# EAGLE design Serial_CAN_Bus_V1.1 (EAGLE 6.4)
DESCRIPTION: microOBD 200 OBD-II Module; HW_REV: 1.4; PCB_REV: C; PCB_SPEC1: Layer Count: 4; PCB_SPEC2: Size: 1.3" x 0.59"; PCB_SPEC3: Finish Thickness: 0.049" - 0.052"; PCB_SPEC4: Copper Weight: 1oz; TITLE: STM1120

## Sheet 1 of 2
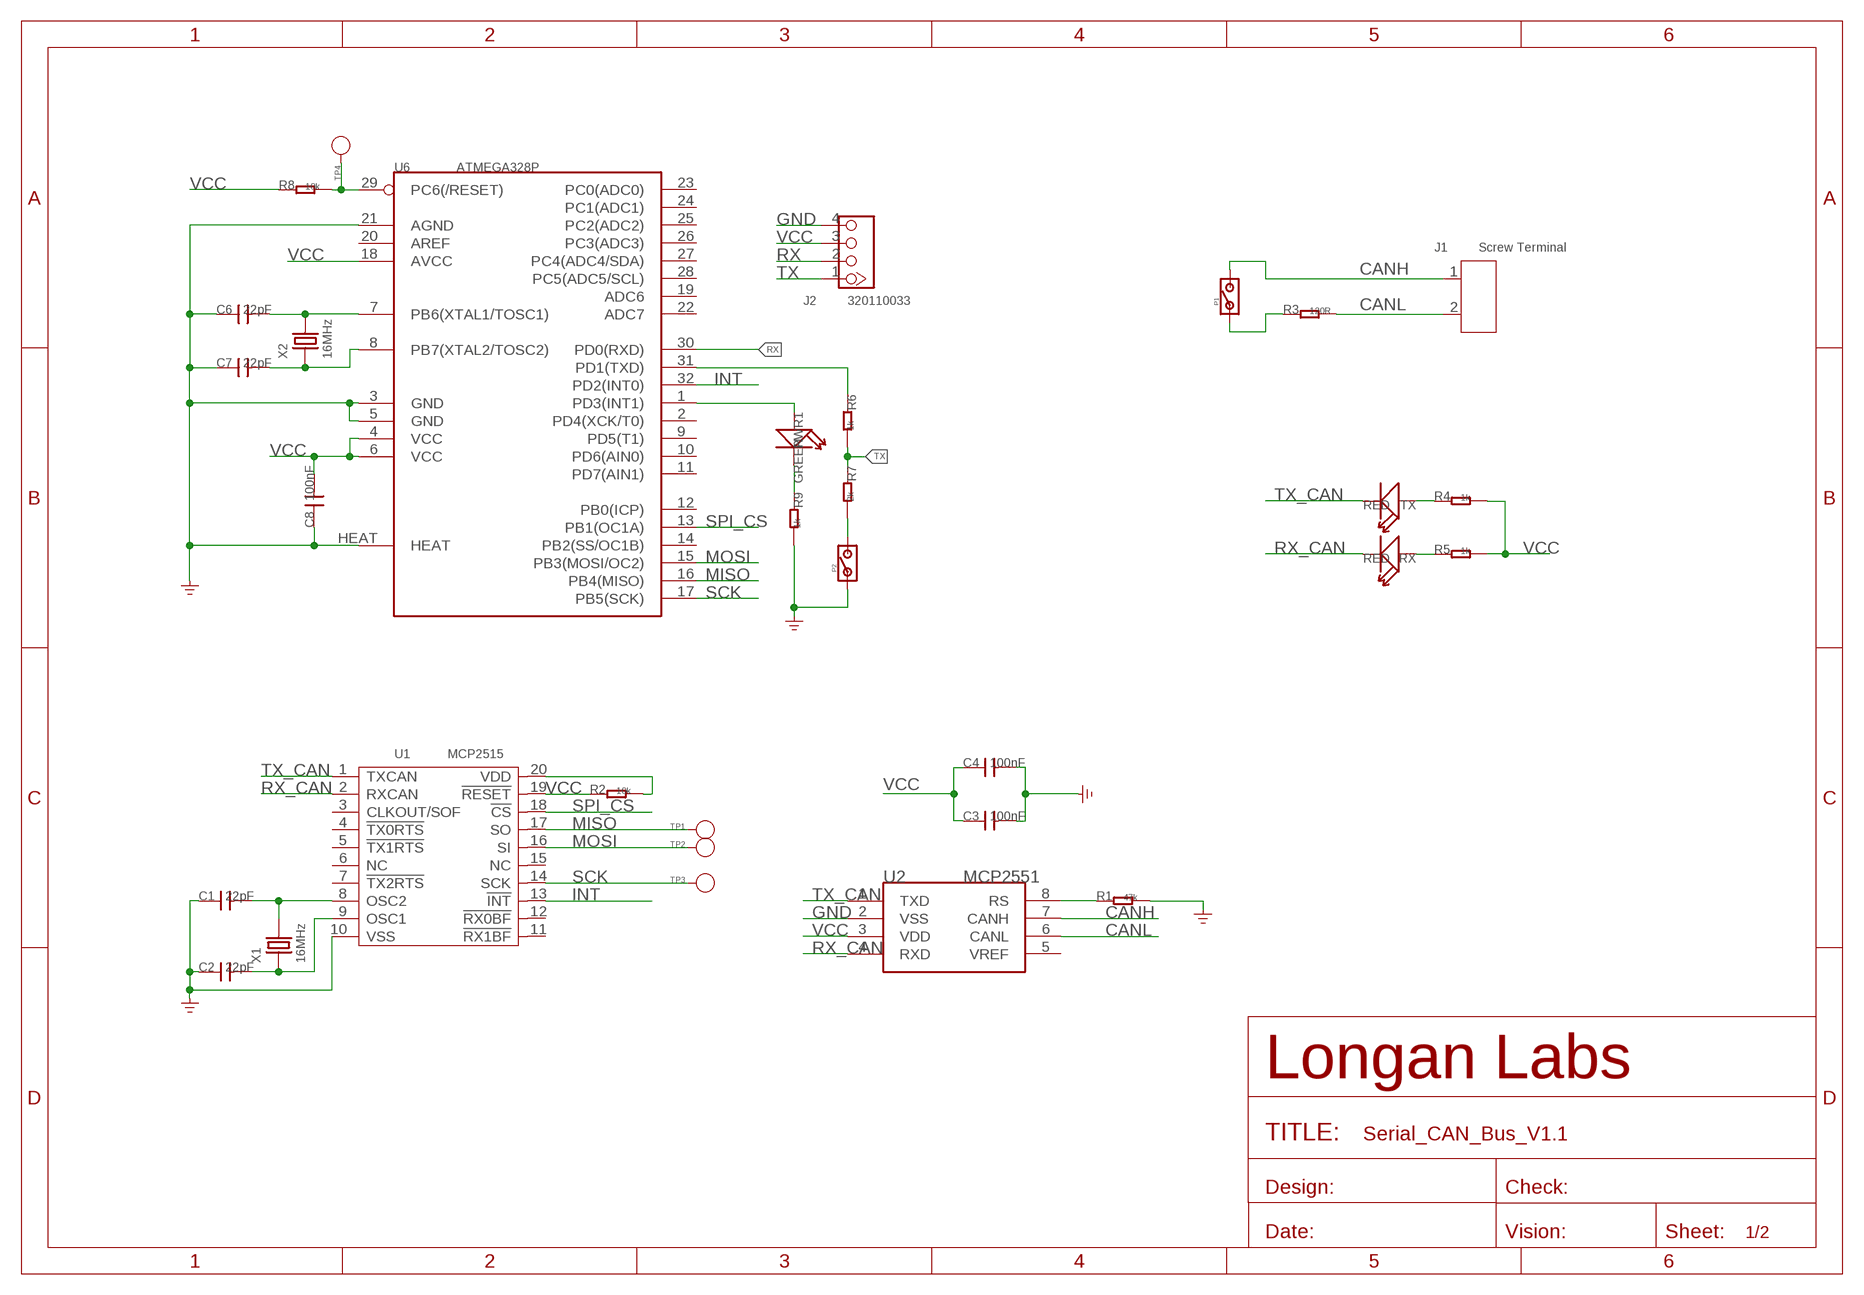
[diagram p0: schematic, sheet 1]

### Parts
C1  22pF  C-0603  [0603]
C2  22pF  C-0603  [0603]
C3  100nF  C-0603  [0603]
C4  100nF  C-0603  [0603]
C6  22pF  C-0603  [0603]
C7  22pF  C-0603  [0603]
C8  100nF  C-0603  [0603]
J1  Screw Terminal  SCREW-TERMINAL-2P'3.5'  [2P-3.5]
J2  320110033  GROVE-CONNECTOR-DIP-2.0  [HW4-2.0]
P1  PAD-JUMPER-2P  [2P-SMD-1.78X1.27]
P2  PAD-JUMPER-2P  [2P-SMD-1.78X1.27]
PWR1  GREEN  LED'0603'  [LED-0603]
R1  47k  R-0603  [0603]
R2  10k  R-0603  [0603]
R3  120R  R-0603  [0603]
R4  1k  R-0603  [0603]
R5  1k  R-0603  [0603]
R6  1k  R-0603  [0603]
R7  2k  R-0603  [0603]
R8  10k  R-0603  [0603]
R9  1k  R-0603  [0603]
RX  RED  LED'0603'  [LED-0603]
TP1  PAD-TEST-POINT'4545'  [TP_4545]
TP2  PAD-TEST-POINT'4545'  [TP_4545]
TP3  PAD-TEST-POINT'4545'  [TP_4545]
TP4  PAD-TEST-POINT'4545'  [TP_4545]
TX  RED  LED'0603'  [LED-0603]
U1  MCP2515  MCP2515'ST'  [TSSOP20-0.65-6.5X4.4MM]
U2  MCP2551  MCP2551-SOIC8  [SOIC8-6.0]
U6  ATMEGA328P  MEGA8  [MLF32X]
X1  16MHz  CRYSTAL-2P'5032'  [X2-SMD-5.0X3.2X1.3MM]
X2  16MHz  CRYSTAL-2P'5032'  [X2-SMD-5.0X3.2X1.3MM]

### Nets
CANH: J1.1 P1.2 U2.7(CANH)
CANL: J1.2 R3.2 U2.6(CANL)
GND: C1.1 C2.1 C3.2 C4.2 C6.1 C7.1 C8.1 J2.4 P2.1 R1.2 R9.2 U1.10(VSS) U2.2(VSS) U6.3(GND) U6.5(GND) U6.21(AGND) U6.HEAT
INT: U1.13(!INT) U6.32(PD2(INT0))
MISO: TP1.T U1.17(SO) U6.16(PB4(MISO))
MOSI: TP2.T U1.16(SI) U6.15(PB3(MOSI/OC2))
N$1: P1.1 R3.1
N$2: R4.1 TX.+
N$3: C6.2 U6.7(PB6(XTAL1/TOSC1)) X2.2
N$4: C7.2 U6.8(PB7(XTAL2/TOSC2)) X2.1
N$5: R8.2 TP4.T U6.29(PC6(/RESET))
N$6: PWR1.+ U6.1(PD3(INT1))
N$7: PWR1.- R9.1
N$8: R6.1 U6.31(PD1(TXD))
N$10: P2.2 R7.2
N$15: R5.1 RX.+
N$16: C1.2 U1.8(OSC2) X1.2
N$17: C2.2 U1.9(OSC1) X1.1
N$20: R1.1 U2.8(RS)
RST_N: R2.1 U1.19(!RESET)
RX: J2.2 U6.30(PD0(RXD))
RX_CAN: RX.- U1.2(RXCAN) U2.4(RXD)
SCK: TP3.T U1.14(SCK) U6.17(PB5(SCK))
SPI_CS: U1.18(!CS) U6.13(PB1(OC1A))
TX: J2.1 R6.2 R7.1
TX_CAN: TX.- U1.1(TXCAN) U2.1(TXD)
VCC: C3.1 C4.1 C8.2 J2.3 R2.2 R4.2 R5.2 R8.1 U1.20(VDD) U2.3(VDD) U6.4(VCC) U6.6(VCC) U6.18(AVCC)
Unconnected: U1.3(CLKOUT/SOF) U1.4(!TX0RTS) U1.5(!TX1RTS) U1.6(NC) U1.7(!TX2RTS) U1.11(!RX1BF) U1.12(!RX0BF) U1.15(NC) U2.5(VREF) U6.2(PD4(XCK/T0)) U6.9(PD5(T1)) U6.10(PD6(AIN0)) U6.11(PD7(AIN1)) U6.12(PB0(ICP)) U6.14(PB2(SS/OC1B)) U6.19(ADC6) U6.20(AREF) U6.22(ADC7) U6.23(PC0(ADC0)) U6.24(PC1(ADC1)) U6.25(PC2(ADC2)) U6.26(PC3(ADC3)) U6.27(PC4(ADC4/SDA)) U6.28(PC5(ADC5/SCL))

## Sheet 2 of 2

## Library data of the parts
C1-C4 C6-C8 = Discrete:C*: Ceramic Capacitors
J1 = Connector-new:SCREW-TERMINAL-2P: 2P-3.5:320110028;2P-5.0:320110031
J2 = Connector-new:GROVE-CONNECTOR-DIP: 4P-2.0:320110033;4P-2.0-90D:320110034
P1 P2 = Discrete:PAD-JUMPER-2P
PWR1 RX TX = Discrete:LED*
R1-R9 = Discrete:R*
TP1-TP4 = Discrete:PAD-TEST-POINT; PARTNO: DNP
U1 = Heilight:MCP2515
U2 = IC:MCP2551: High-Speed CAN Transceiver http://ww1.microchip.com/downloads/en/devicedoc/21667f.pdf
U6 = ICs_v54:MEGA8
X1 X2 = Discrete-new:CRYSTAL-2P

## Net classes
0 default: width 0.152 mm, clearance 0.152 mm
3 usbvcc: width 0.152 mm, drill 0.152 mm, clearance 0.152 mm

## Board
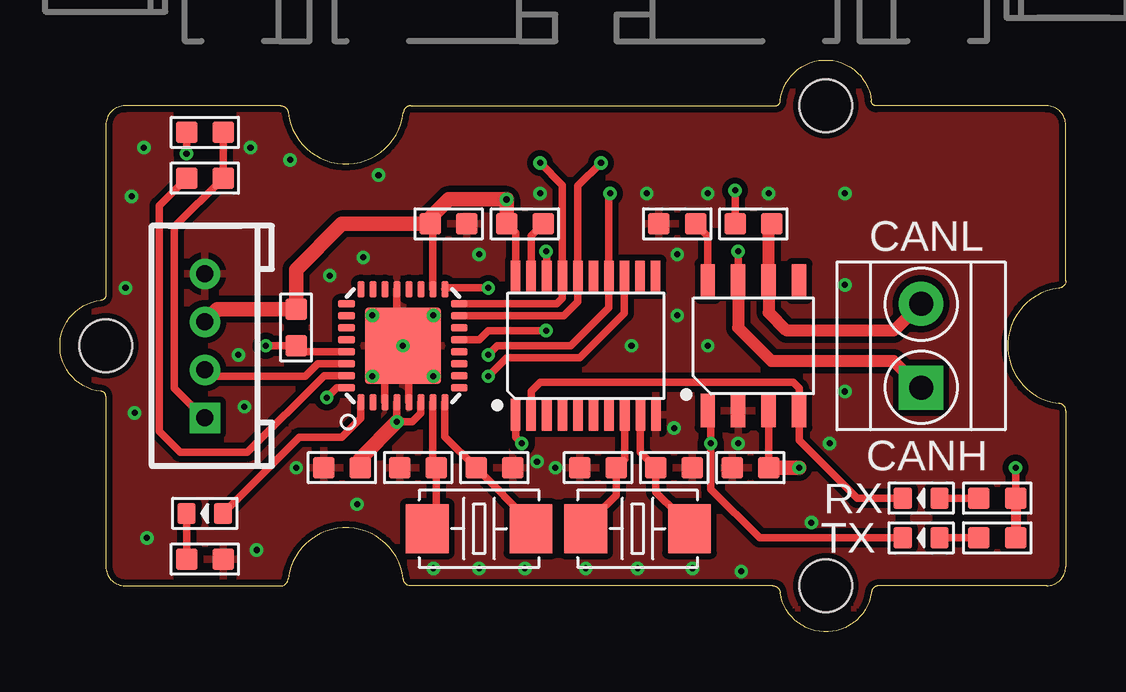
[diagram p1: board, top side]
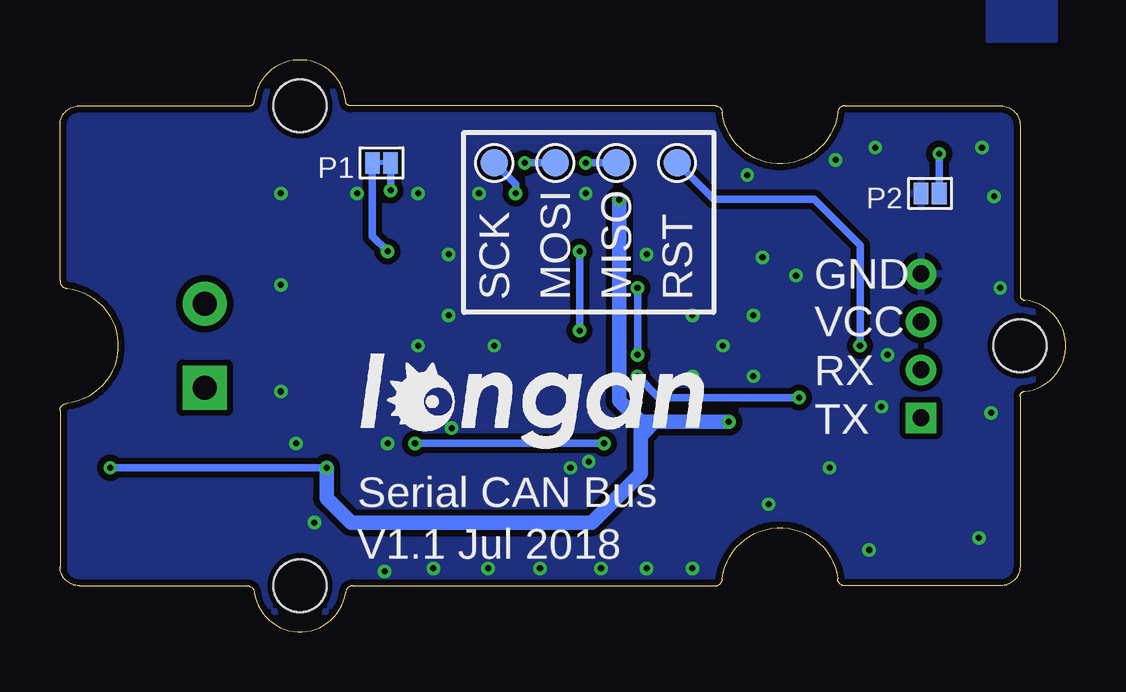
[diagram p2: board, bottom side, seen from below]

Size 41.91 x 23.83 mm. Coordinates in mm from the lower left corner, seen from the top.
Copper layers (1*16): Top 0.035mm / dielectric 1.5mm / Bottom 0.035mm
Design rules "SeeedStudio_2layer_DRU_no_angle_20140221": minimum track width 6mil, minimum drill 12mil, track to track 6mil, track to pad 6mil, pad to pad 6mil, via to via 6mil, smd to smd 0mil, copper to edge 10mil, drill to drill 10mil, minimum pad ring 10mil, minimum via ring 6mil, stop-mask expansion 2mil, vias tented up to drill 25mil, thermal gap 10mil

### Footprints (pad centres in the part's own frame; a part is rotated, then mirrored left to right if it is on the bottom)
0603 = smd 0.889 x 0.889: 1 -0.762,0; 2 0.762,0
2P-3.5 = drill 1 pad 1.85 square: 1 -1.75,0 | drill 1 pad 1.85: 2 1.75,0
HW4-2.0 = drill 0.7 pad 1.27 square: 1 -3,0 | drill 0.7 pad 1.27: 2 -1,0; 3 1,0; 4 3,0
2P-SMD-1.78X1.27 = smd 0.889 x 0.61: 1 0,0.381; 2 0,-0.381
LED-0603 = smd 0.762 x 0.889: + -0.762,0; - 0.762,0
TP_4545 = smd 1.143 x 1.143: T 0,0
TSSOP20-0.65-6.5X4.4MM = smd 0.4 x 1.35: 1 -2.925,-2.875; 2 -2.275,-2.875; 3 -1.625,-2.875; 4 -0.975,-2.875; 5 -0.325,-2.875; 6 0.325,-2.875; 7 0.975,-2.875; 8 1.625,-2.875; 9 2.275,-2.875; 10 2.925,-2.875; 11 2.91,2.875; 12 2.26,2.875; 13 1.61,2.875; 14 0.96,2.875; 15 0.325,2.875; 16 -0.325,2.875; 17 -0.975,2.875; 18 -1.625,2.875; 19 -2.275,2.875; 20 -2.925,2.875
SOIC8-6.0 = smd 0.6 x 1.4: 1 -1.905,-2.7; 2 -0.635,-2.7; 3 0.635,-2.7; 4 1.905,-2.7; 5 1.905,2.7; 6 0.635,2.7; 7 -0.635,2.7; 8 -1.905,2.7
GROVE-TEST-PLATFORM = hole 2.2: -10,-10; -10,10; 20,0
MLF32X = smd 0.7 x 0.3: 1 -2.35,1.75; 2 -2.35,1.25; 3 -2.35,0.75; 4 -2.35,0.25; 5 -2.35,-0.25; 6 -2.35,-0.75; 7 -2.35,-1.25; 8 -2.35,-1.75; 17 2.35,-1.75; 18 2.35,-1.25; 19 2.35,-0.75; 20 2.35,-0.25; 21 2.35,0.25; 22 2.35,0.75; 23 2.35,1.25; 24 2.35,1.75 | smd 0.3 x 0.7: 9 -1.75,-2.35; 10 -1.25,-2.35; 11 -0.75,-2.35; 12 -0.25,-2.35; 13 0.25,-2.35; 14 0.75,-2.35; 15 1.25,-2.35; 16 1.75,-2.35; 25 1.75,2.35; 26 1.25,2.35; 27 0.75,2.35; 28 0.25,2.35; 29 -0.25,2.35; 30 -0.75,2.35; 31 -1.25,2.35; 32 -1.75,2.35 | smd 3.175 x 3.175: HEAT 0,0
X2-SMD-5.0X3.2X1.3MM = smd 1.778 x 2.032: 1 -2.159,0; 2 2.159,0

### Placement (x,y rotation side)
C1  22.42,6.84 0 top
C2  25.59,6.84 180 top
C3  28.77,6.84 180 top
C4  16.19,17 0 top
C6  14.92,6.84 0 top
C7  18.1,6.84 180 top
C8  11.75,6.84 0 top
J1  35.88,11.92 90 top
J2  6.03,11.92 90 top
P1  28.51,19.54 270 bottom
P2  5.65,18.27 90 bottom
PWR1  6.03,4.94 180 top
R1  25.72,17 180 top
R2  19.37,17 180 top
R3  28.89,17 0 top
R4  39.05,3.92 0 top
R5  39.05,5.57 0 top
R6  6.03,18.91 0 top
R7  6.03,20.81 180 top
R8  9.84,12.68 270 top
R9  6.03,3.03 0 top
RX  35.88,5.57 180 top
TP1  18.73,19.54 0 bottom
TP2  21.27,19.54 0 bottom
TP3  23.81,19.54 0 bottom
TP4  16.19,19.54 0 bottom
TX  35.88,3.92 180 top
U1  21.91,11.92 0 top
U2  28.89,11.92 0 top
U3  [GROVE-TEST-PLATFORM]  21.91,11.92 180 top
U6  14.29,11.92 90 top
U$5  [LONGAN-SILK-SMALLER]  30.67,6.46 0 bottom
X1  24.07,4.3 180 top
X2  17.46,4.3 180 top

### Tracks (layer width: path | path; a pad name or v marks a point on that pad's centre or on a via)
CANH  (via drill 0.25 pad 0.51)
  Top 0.305: U2.7 v28.26,15.86
  Top 0.508: 35.85,10.17 34.74,11.29 29.66,11.29 28.26,12.68 U2.7
  Top 0.813: J1.1 35.85,10.17
  Bottom 0.203: 28.26,19.54 P1.2
  Bottom 0.305: v28.26,15.86 28.89,16.49 P1.2
CANL
  Top 0.508: 35.85,13.67 34.74,12.56 30.29,12.56 29.53,13.32 U2.6 29.53,16.87 R3.2
  Top 0.813: J1.2 35.85,13.67
GND  (via drill 0.25 pad 0.51)
  Top 0.305: U6.21 14.04,12.69 14.03,12.68 14.03,12.18 U6.HEAT | U6.5 14.54,11.67 U6.HEAT | U6.3 13.54,11.55 13.65,11.67 14.03,11.67 U6.HEAT
  other vias: 17.46,15.73 13.02,13.19 15.56,13.19 15.56,10.65 13.02,10.65 14.29,11.92 9.84,6.84 12.38,5.32 20.64,6.84 19.88,7.1 25.59,8.49 28.26,7.86 28.39,2.52 32.07,7.86 31.31,4.56 25.72,15.73 25.72,13.19 23.81,11.92 26.99,11.92 24.45,18.27 26.99,18.27 29.53,18.27 11.24,14.84 9.59,19.67 13.27,19.03 12.64,15.6 20,18.27 7.94,20.18 2.73,14.33 3.49,20.18 32.7,14.46 32.7,10.02 32.7,18.27 15.56,2.65 17.46,2.65 19.37,2.65 21.91,2.65 24.07,2.65 26.35,2.65 2.99,18.14 3.11,9.13 3.62,3.92 8.19,3.41 7.68,9.38 7.43,11.54
  pour Bottom: 0.45,24.62 3.24,24.62 3.24,27.54 0.45,27.54
  pour Bottom (isolate 0.254): -0.32,-0.14 42.23,-0.14 42.23,23.99 -0.32,23.99
  pour Top (isolate 0.254): -0.32,-0.14 42.23,-0.14 42.23,23.99 -0.32,23.99
INT  (via drill 0.25 pad 0.51)
  Top 0.305: U6.32 11.52,10.17 v11.11,9.76 | U1.13 23.52,13.28 21.65,11.41 18.61,11.41 v17.84,10.65
  Bottom 0.305: v17.84,10.65 16.96,9.76 v11.11,9.76
MISO  (via drill 0.25 pad 0.51)
  Top 0.305: U6.16 20.7,13.67 20.93,13.9 U1.17 20.93,18.61 v20,19.54
  Bottom 0.305: v20,19.54 TP1.T
MOSI  (via drill 0.25 pad 0.51)
  Top 0.305: U6.15 20.99,13.17 21.58,13.76 U1.16 21.58,18.58 v22.54,19.54
  Bottom 0.305: v22.54,19.54 TP2.T
N$1  (via drill 0.25 pad 0.51)
  Top 0.305: v28.13,18.4 R3.1
  Bottom 0.305: P1.1 v28.13,18.4
N$2
  Top 0.305: R4.1 TX.+
N$3
  Top 0.305: U6.7 15.54,6.99 C6.2 15.69,3.92 | 15.69,3.92 15.81,3.79 | 15.69,3.92 X2.2
N$4
  Top 0.305: U6.8 16.04,8.14 C7.2 19.62,4.56 X2.1
N$5  (via drill 0.25 pad 0.51)
  Top 0.305: U6.29 9.85,11.67 R8.2 v8.57,11.92
  Bottom 0.305: v8.57,11.92 8.57,16.11 10.48,18.02 14.67,18.02 TP4.T
N$6
  Top 0.305: U6.1 12.54,8.9 11.75,8.11 9.97,8.11 PWR1.+
N$7
  Top 0.305: PWR1.- R9.1
N$8
  Top 0.305: U6.31 11.01,10.67 7.81,7.48 5.02,7.48 4.13,8.37 4.13,17.76 R6.1
N$10  (via drill 0.25 pad 0.51)
  Top 0.305: v5.27,19.92 R7.2
  Bottom 0.305: P2.2 v5.27,19.92
N$15
  Top 0.305: RX.+ R5.1
N$16
  Top 0.305: U1.8 23.53,7.2 C1.2 23.18,5.7 22.29,4.81 22.29,4.68 X1.2
N$17
  Top 0.305: U1.9 24.18,7.49 C2.2 24.83,5.83 25.72,4.94 25.72,4.81 X1.1
N$20
  Top 0.305: U2.8 26.99,16.49 R1.1
RST_N
  Top 0.305: U1.19 19.63,16.5 R2.1
RX
  Top 0.305: U6.30 10.74,11.17 10.22,10.65 6.3,10.65 J2.2
RX_CAN
  Top 0.305: U1.2 19.63,10.03 20,10.4 30.54,10.4 30.8,10.14 U2.4 30.8,7.98 33.21,5.57 RX.-
SCK  (via drill 0.25 pad 0.51)
  Top 0.305: v17.84,14.33 16.1,14.33 U6.17 | v17.84,11.54 18.23,11.92 21.27,11.92 22.87,13.52 U1.14 22.87,18.22 v22.92,18.27
  Bottom 0.305: v17.84,11.54 v17.84,14.33 | v22.92,18.27 22.92,18.65 TP3.T
SPI_CS  (via drill 0.25 pad 0.51)
  Top 0.305: U1.18 20.28,15.83 v20.26,15.86 | v20.26,12.56 17.84,12.56 17.46,12.17 U6.13
  Bottom 0.305: v20.26,15.86 v20.26,12.56
TX
  Top 0.305: J2.1 5.99,8.92 4.76,10.14 4.76,16.87 R6.2 R7.1
TX_CAN  (via drill 0.25 pad 0.51)
  Top 0.305: TX.- 29.15,3.92 27.12,5.95 27.12,7.35 v27.12,7.86 27.12,9.09 U2.1 | U1.1 18.98,8.12 v19.24,7.86
  Bottom 0.305: v19.24,7.86 v27.12,7.86
VCC  (via drill 0.25 pad 0.51)
  Top 0.305: U6.4 v14.04,8.75 14.67,8.75 15.04,9.12 U6.6 | U6.18 15.54,16.89 C4.1 | U1.20 18.98,16.62 R2.2 | U2.3 C3.1 | R5.2 v39.82,6.84
  Top 0.406: R5.2 R4.2
  Top 0.61: J2.3 6.56,13.45 R8.1 9.84,15.1 11.75,17 C4.1 15.43,17.26 16.19,18.02 v18.61,18.02 R2.2 18.61,17.13 | v30.8,6.84 C3.1 | C8.2 12.51,7.22 v14.04,8.75
  Bottom 0.305: v39.82,6.84 v30.8,6.84
  Bottom 0.61: v18.61,18.02 18.61,9.64 17.72,8.75 | v30.8,6.84 30.8,5.57 29.78,4.56 19.75,4.56 17.72,6.59 17.72,8.75 | 17.72,8.75 17.15,8.75 | 17.15,8.75 v14.04,8.75 | 17.15,8.75 17.65,8.24

### Text on the board
tPlace: CANL | CANH | RX | TX
bPlace: P1 | P2 | GND | RST | MISO | MOSI | SCK | VCC | RX | TX | Serial CAN Bus | V1.1 Jul 2018